# EAGLE schematic mainboard (EAGLE 6.4)
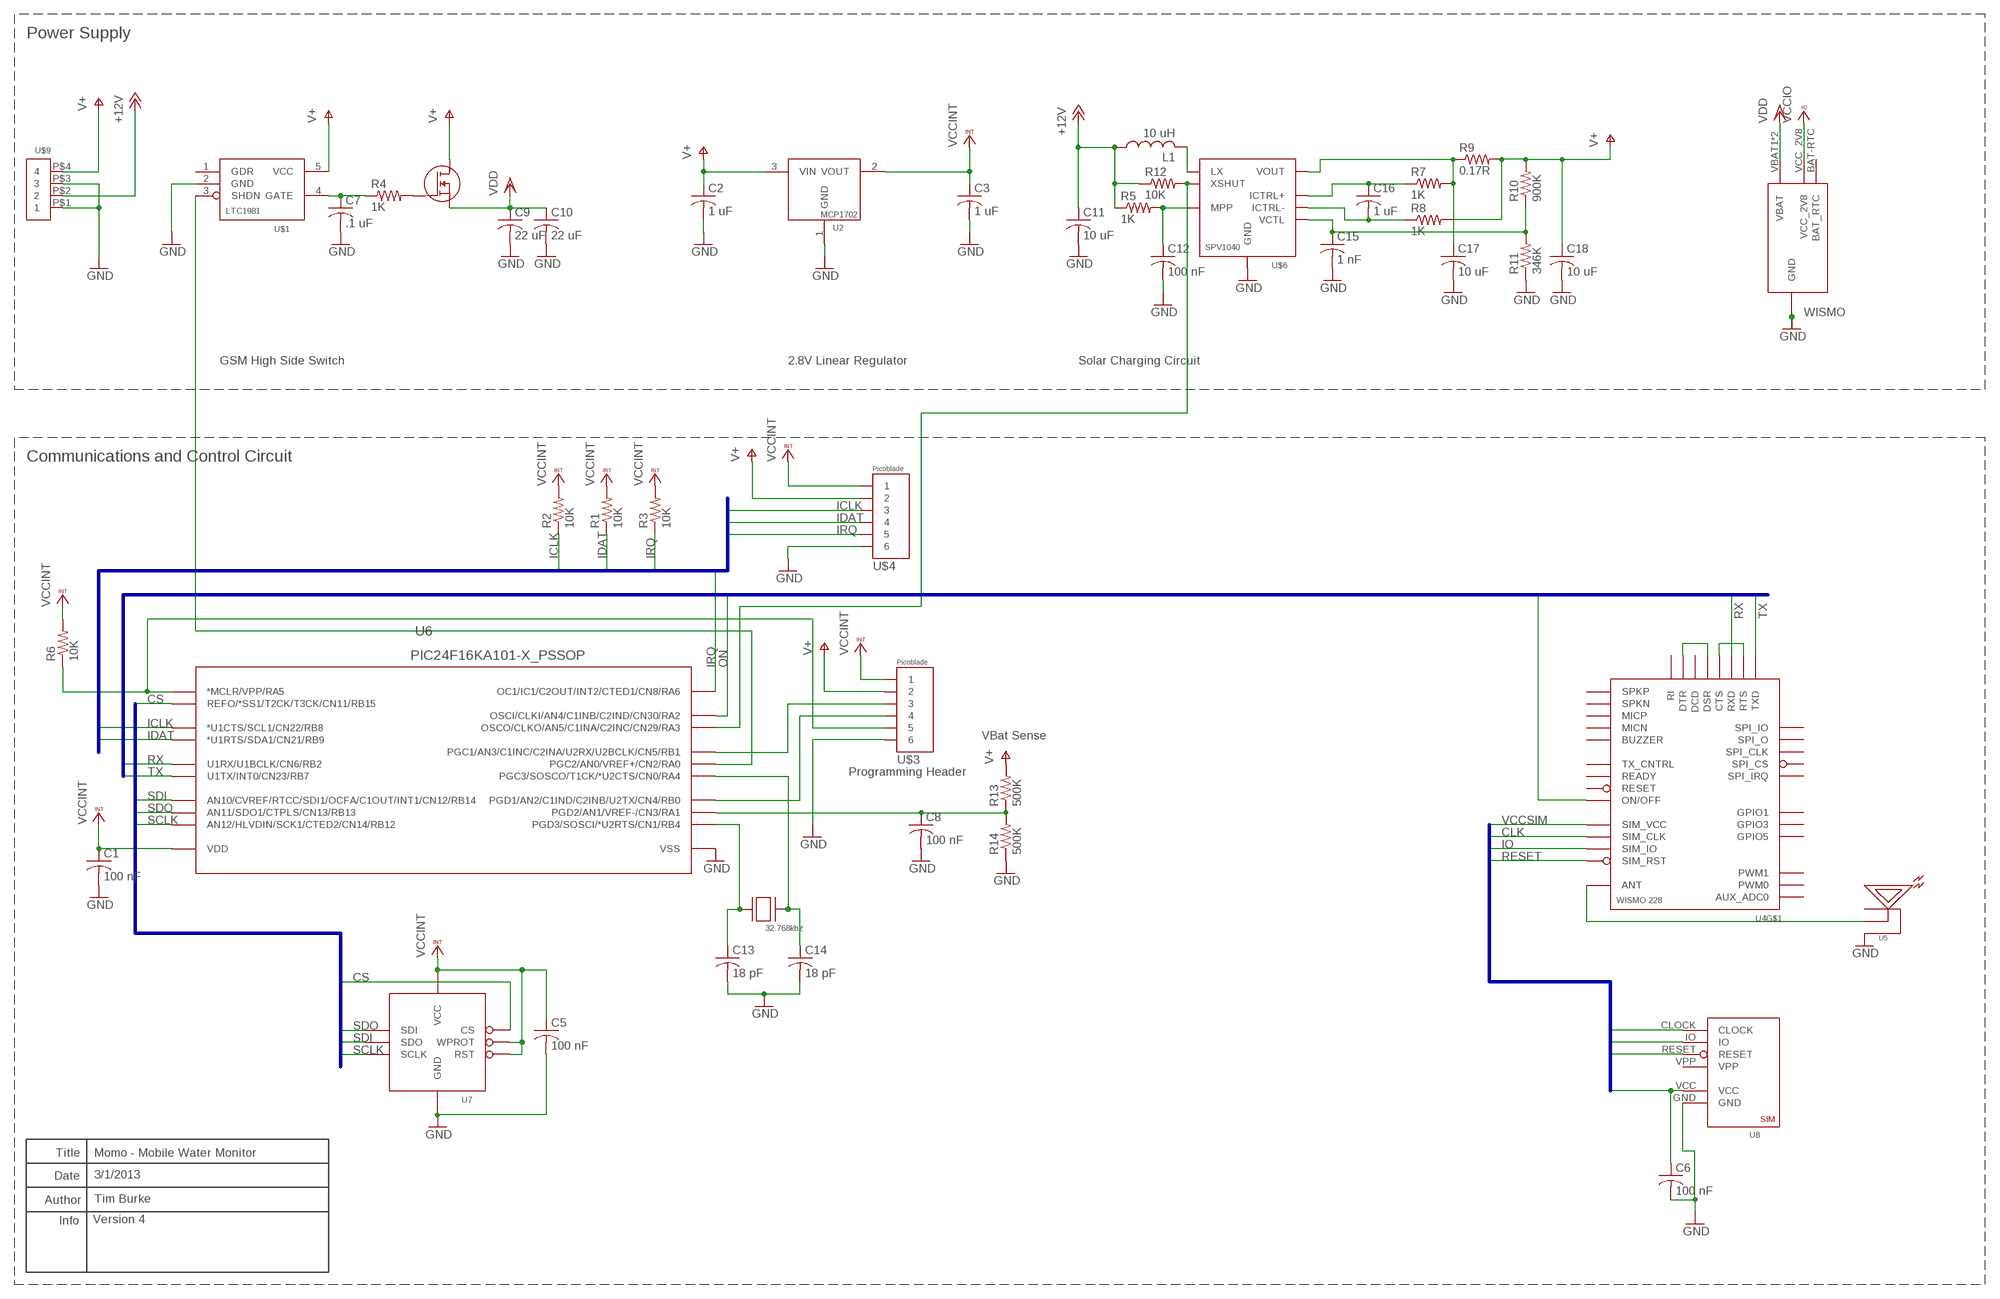
[diagram p0: schematic, sheet 1]

## Parts
C1  100 nF  C-USC0402  [C0402]
C2  1 uF  C-USC0402  [C0402]
C3  1 uF  C-USC0402  [C0402]
C5  100 nF  C-USC0402  [C0402]
C6  100 nF  C-USC0402K  [C0402K]
C7  .1 uF  C-USC0402  [C0402]
C8  100 nF  C-USC0402  [C0402]
C9  22 uF  C-USC1206  [C1206]
C10  22 uF  C-USC1206  [C1206]
C11  10 uF  C-USC0805  [C0805]
C12  100 nF  C-USC0402  [C0402]
C13  18 pF  C-USC0402K  [C0402K]
C14  18 pF  C-USC0402K  [C0402K]
C15  1 nF  C-USC0402  [C0402]
C16  1 uF  C-USC0402  [C0402]
C17  10 uF  C-USC0805  [C0805]
C18  10 uF  C-USC0805  [C0805]
L1  10 uH  L-COILCRAFT  [L-COILCRAFT]
R1  10K  R-US_R0603  [R0603]
R2  10K  R-US_R0603  [R0603]
R3  10K  R-US_R0603  [R0603]
R4  1K  R-US_R0603  [R0603]
R5  1K  R-US_R0603  [R0603]
R6  10K  R-US_R0603  [R0603]
R7  1K  R-US_R0603  [R0603]
R8  1K  R-US_R0603  [R0603]
R9  0.17R  R-US_R0805  [R0805]
R10  900K  R-US_R0603  [R0603]
R11  346K  R-US_R0603  [R0603]
R12  10K  R-US_R0603  [R0603]
R13  500K  R-US_R0603  [R0603]
R14  500K  R-US_R0603  [R0603]
U2  MCP1702  [SOT23]
U4  WISMO_228  [GSM_MODULE]
U5  RFANTENNA  [RFJACK]
U6  PIC24F16KA101-X_PSSOP  [SSOP20]
U7  FLASH8MSOP8  [SOP08]
U8  SIMSLOT  [SIMSLOT]
U$1  LTC1981  [SOT23-5L]
U$3  MICROCON6  [MICROCON6]
U$4  MICROCON6  [MICROCON6]
U$5  N-MOSFET  [SSOT-3]
U$6  SPV1040  [TSSOP8]
U$9  SCREWTERM4  [SCREWTERM4]
XTAL1  32.768khz  SMD-XTAL  [1206]

## Nets
+12V: C11.1 L1.P$1 R5.1 R12.1 U$9.P$2
CLK: U4.SIM_CLK U8.CLOCK
CS: U6.18(REFO/*SS1/T2CK/T3CK/CN11/RB15) U7.1(CS)
GND: C1.2 C2.2 C3.2 C5.2 C6.2 C7.2 C8.2 C9.2 C10.2 C11.2 C12.2 C13.2 C14.2 C15.2 C17.2 C18.2 R11.1 R14.1 U2.1(GND) U4.GND U4.GND1(GND) U4.GND2(GND) U4.GND3(GND) U4.GND4(GND) U4.GND5(GND) U5.UNUSED1(SHIELD) U5.UNUSED2(SHIELD) U6.19(VSS) U7.4(GND) U8.GND U$1.2(GND) U$3.6 U$4.6 U$6.2(GND) U$9.P$1 U$9.P$3
ICLK: R2.1 U6.12(*U1CTS/SCL1/CN22/RB8) U$4.3
IDAT: R1.1 U6.13(*U1RTS/SDA1/CN21/RB9) U$4.4
IO: U4.SIM_IO U8.IO
IRQ: R3.1 U6.14(OC1/IC1/C2OUT/INT2/CTED1/CN8/RA6) U$4.5
N$1: U4.ANT U5.ANTENNA(PIN)
N$3: U4.CT107/DSR(DSR) U4.CT108/DTR(DTR)
N$4: R4.2 U$5.1(GATE)
N$5: C12.1 R5.2 U$6.1(MPP)
N$6: C7.1 R4.1 U$1.4(GATE)
N$7: U6.2(PGC2/AN0/VREF+/CN2/RA0) U$1.3(SHDN)
N$8: L1.P$2 U$6.3(LX)
N$9: C15.1 R10.1 R11.2 U$6.5(VCTL)
N$10: C17.1 R7.2 R9.1 U$6.4(VOUT)
N$11: C16.1 R7.1 U$6.7(ICTRL+)
N$12: C16.2 R8.1 U$6.6(ICTRL-)
N$13: R12.2 U6.8(OSCO/CLKO/AN5/C1INA/C2INC/CN29/RA3) U$6.8(XSHUT)
N$15: R6.1 U6.1(*MCLR/VPP/RA5) U$3.5
N$16: C8.1 R13.1 R14.2 U6.3(PGD2/AN1/VREF-/CN3/RA1)
N$18: U6.5(PGC1/AN3/C1INC/C2INA/U2RX/U2BCLK/CN5/RB1) U$3.3
N$19: U6.4(PGD1/AN2/C1IND/C2INB/U2TX/CN4/RB0) U$3.4
N$23: U4.CT105/RTS(RTS) U4.CT106/CTS(CTS)
N$24: C14.1 U6.10(PGC3/SOSCO/T1CK/*U2CTS/CN0/RA4) XTAL1.P$2(XTAL2)
N$25: C13.1 U6.9(PGD3/SOSCI/*U2RTS/CN1/RB4) XTAL1.P$1(XTAL1)
ON: U4.ON/OFF U6.7(OSCI/CLKI/AN4/C1INB/C2IND/CN30/RA2)
RESET: U4.SIM_RST U8.RESET
RX: U4.CT104/RXD(RXD) U6.6(U1RX/U1BCLK/CN6/RB2)
SCLK: U6.15(AN12/HLVDIN/SCK1/CTED2/CN14/RB12) U7.6(SCLK)
SDI: U6.17(AN10/CVREF/RTCC/SDI1/OCFA/C1OUT/INT1/CN12/RB14) U7.2(SDO)
SDO: U6.16(AN11/SDO1/CTPLS/CN13/RB13) U7.5(SDI)
TX: U4.CT103/TXD(TXD) U6.11(U1TX/INT0/CN23/RB7)
V+: C2.1 C18.1 R8.2 R9.2 R10.2 R13.2 U2.3(VIN) U$1.5(VCC) U$3.2 U$4.2 U$5.3(DRAIN) U$9.P$4
VCCINT: C1.1 C3.1 C5.1 R1.2 R2.2 R3.2 R6.2 U2.2(VOUT) U6.20(VDD) U7.3(WPROT) U7.7(RST) U7.8(VCC) U$3.1 U$4.1
VCCIO: U4.VCC_2V8
VCCSIM: C6.1 U4.SIM_VCC U8.VCC
VDD: C9.1 C10.1 U4.VBAT1(VBAT) U4.VBAT2(VBAT) U$5.2(SOURCE)
Unconnected: U4.AUX_ADC0 U4.BAT-RTC(BAT_RTC) U4.BUZZER U4.CT109/DCD(DCD) U4.CT125/RI(RI) U4.GPIO1 U4.GPIO3 U4.GPIO5 U4.MICN U4.MICP U4.PWM0 U4.PWM1 U4.RESET U4.SPI-CLK(SPI_CLK) U4.SPI-CS(SPI_CS) U4.SPI-IO(SPI_IO) U4.SPI-IRQ(SPI_IRQ) U4.SPI-O(SPI_O) U4.SPKN U4.SPKP U4.TX_CTRL(TX_CNTRL) U4.WISMO_READY(READY) U8.VPP U$1.1(GDR)

## Buses
VCCSIM,CLK,IO,RESET
SPI:CS,SDI,SDO,SCLK
COMMS:TX,RX,READY,ON
SENSOR:ICLK,IDAT,IRQ

## Notes on the sheet
- Power Supply
- WISMO
- GSM High Side Switch | 2.8V Linear Regulator | Solar Charging Circuit
- Communications and Control Circuit
- VBat Sense
- Programming Header
- Title | Momo - Mobile Water Monitor
- Date | 3/1/2013
- Author | Tim Burke
- Info | Version 4

## Library data of the parts
C1-C3 C5-C18 = rcl:C-US: CAPACITOR, American symbol
L1 = components:L-COILCRAFT
R1-R14 = rcl:R-US_: RESISTOR, American symbol
U2 = components:MCP1702
U4 = components:WISMO_228: WISMO 228 GSM Integrated Module from AirPrime
U5 = components:RFANTENNA
U6 = components:PIC24F16KA101-X_P
U7 = components:FLASH8M
U8 = components:SIMSLOT: Molex SIM Card Slot
U$1 = components:LTC1981: Highside MOSFET Driver
U$3 U$4 = components:MICROCON6
U$5 = components:N-MOSFET
U$6 = components:SPV1040
U$9 = components:SCREWTERM4
XTAL1 = components:SMD-XTAL

## Net classes
0 default: width 0.152 mm, drill 0.305 mm, clearance 0.152 mm